# EAGLE schematic Adrian_Flight_Computer_Board (EAGLE 9.6.2)
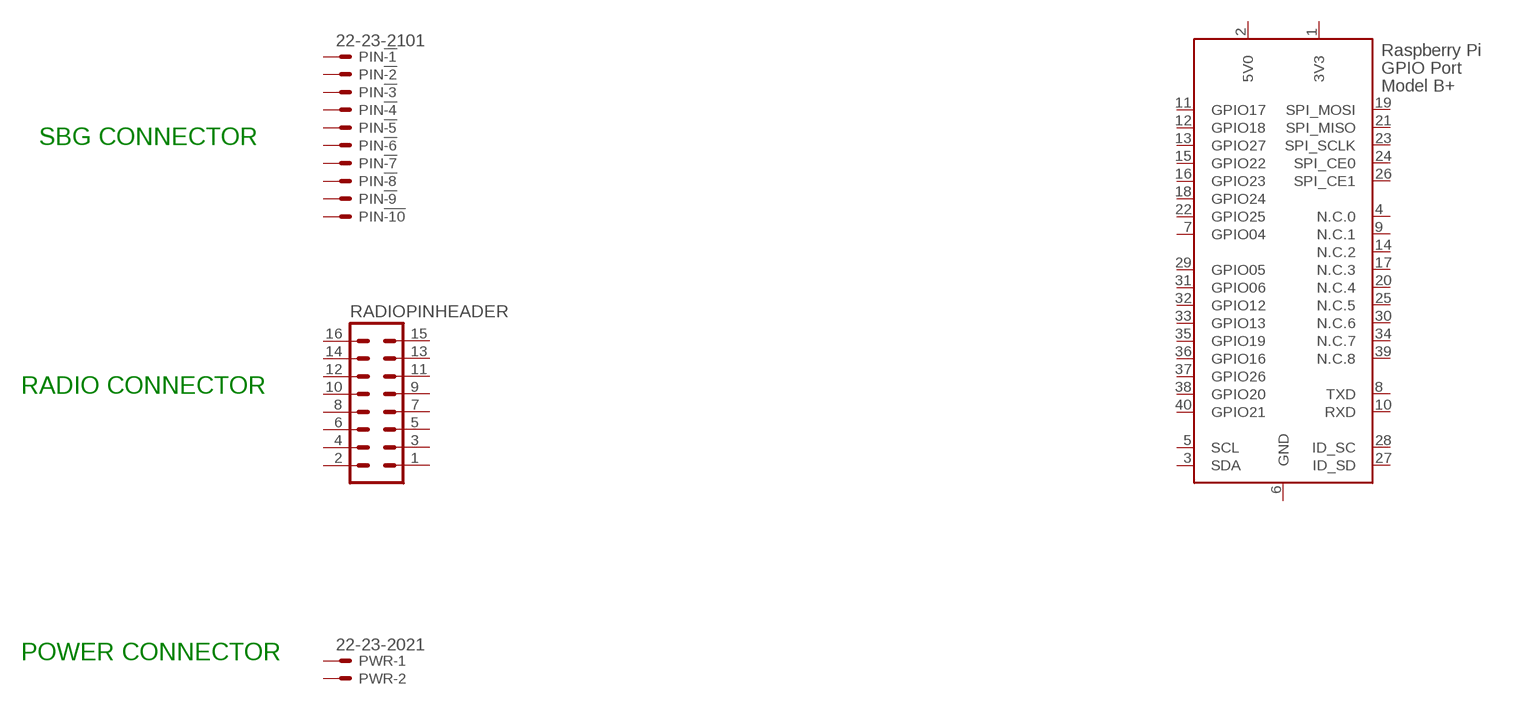
[diagram p0: schematic, sheet 1]

## Parts
PIN!  22-23-2101  [22-23-2101]
PWR  22-23-2021  [22-23-2021]
RADIOPINHEADER  MA08-2  [MA08-2]
X1  RASPI_GPIO_B+_PIN  [RASPI_GPIO_B+_PIN]
Unconnected: PIN!.1 PIN!.2 PIN!.3 PIN!.4 PIN!.5 PIN!.6 PIN!.7 PIN!.8 PIN!.9 PIN!.10 PWR.1 PWR.2 RADIOPINHEADER.1 RADIOPINHEADER.2 RADIOPINHEADER.3 RADIOPINHEADER.4 RADIOPINHEADER.5 RADIOPINHEADER.6 RADIOPINHEADER.7 RADIOPINHEADER.8 RADIOPINHEADER.9 RADIOPINHEADER.10 RADIOPINHEADER.11 RADIOPINHEADER.12 RADIOPINHEADER.13 RADIOPINHEADER.14 RADIOPINHEADER.15 RADIOPINHEADER.16 X1.3(SDA) X1.4(N.C.0) X1.5(SCL) X1.7(GPIO04) X1.8(TXD) X1.9(N.C.1) X1.10(RXD) X1.11(GPIO17) X1.12(GPIO18) X1.13(GPIO27) X1.14(N.C.2) X1.15(GPIO22) X1.16(GPIO23) X1.17(N.C.3) X1.18(GPIO24) X1.19(SPI_MOSI) X1.20(N.C.4) X1.21(SPI_MISO) X1.22(GPIO25) X1.23(SPI_SCLK) X1.24(SPI_CE0) X1.25(N.C.5) X1.26(SPI_CE1) X1.27(ID_SD) X1.28(ID_SC) X1.29(GPIO05) X1.30(N.C.6) X1.31(GPIO06) X1.32(GPIO12) X1.33(GPIO13) X1.34(N.C.7) X1.35(GPIO19) X1.36(GPIO16) X1.37(GPIO26) X1.38(GPIO20) X1.39(N.C.8) X1.40(GPIO21)

## Notes on the sheet
- SBG CONNECTOR
- RADIO CONNECTOR
- POWER CONNECTOR

## Power pins joined to a net without a drawn wire
3V3: X1.1(3V3)
5V0: X1.2(5V0)
GND: X1.6(GND)

## Library data of the parts
PIN! = con-molex:22-23-2101: .100" (2.54mm) Center Header - 10 Pin; MF: MOLEX; MPN: 22-23-2101; OC_FARNELL: 1756828; OC_NEWARK: 94C0765
PWR = con-molex:22-23-2021: .100" (2.54mm) Center Header - 2 Pin; MF: MOLEX; MPN: 22-23-2021; OC_FARNELL: 1462926; OC_NEWARK: 25C3832
RADIOPINHEADER = con-lstb:MA08-2: PIN HEADER; OC_FARNELL: unknown; OC_NEWARK: unknown
X1 = raspberrypi_bastelstube_v13:RASPI_GPIO_B+: Only the 2x20 header connector, nothing else